# EAGLE design beamshutter (EAGLE 9.6.2)
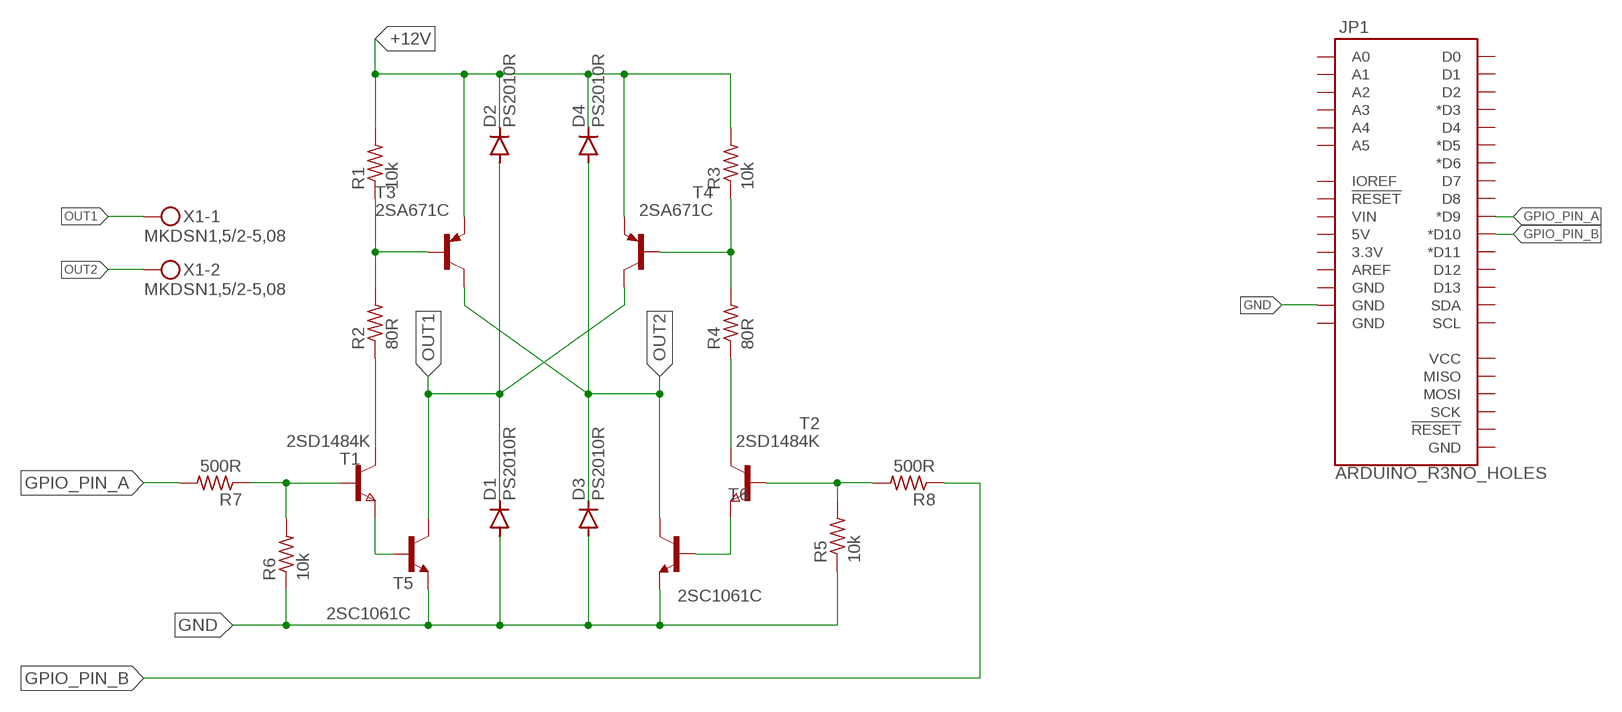
[diagram p0: schematic, sheet 1]

## Parts
D1  PS2010R  RGP15  [DO15-12]
D2  PS2010R  RGP15  [DO15-12]
D3  PS2010R  RGP15  [DO15-12]
D4  PS2010R  RGP15  [DO15-12]
JP1  ARDUINO_R3NO_HOLES  [ARDUINO_R3_NO_HOLES]
R1  10k  R-2012  [2012-R]
R2  80R  R-2012  [2012-R]
R3  10k  R-2012  [2012-R]
R4  80R  R-2012  [2012-R]
R5  10k  R-2012  [2012-R]
R6  10k  R-2012  [2012-R]
R7  500R  R-2012  [2012-R]
R8  500R  R-2012  [2012-R]
T1  2SD1484K  NPNSOT323  [SOT323]
T2  2SD1484K  NPNSOT323  [SOT323]
T3  2SA671C  -PNP-TO220V  [TO220V]
T4  2SA671C  -PNP-TO220V  [TO220V]
T5  2SC1061C  -NPN-TO220V  [TO220V]
T6  2SC1061C  -NPN-TO220V  [TO220V]
X1  MKDSN1,5/2-5,08  [MKDSN1,5/2-5,08]

## Nets
+12V: D2.C D4.C R1.2 R3.2 T3.3(E) T4.3(E)
GND: D1.A D3.A JP1.GND@3(GND) R5.1 R6.1 T5.3(E) T6.3(E)
GPIO_PIN_A: JP1.D9(*D9) R7.2
GPIO_PIN_B: JP1.D10(*D10) R8.1
N$1: R6.2 R7.1 T1.2(B)
N$2: R1.1 R2.2 T3.1(B)
N$3: R3.1 R4.2 T4.1(B)
N$4: R5.2 R8.2 T2.2(B)
N$5: T1.3(E) T5.1(B)
N$6: T2.3(E) T6.1(B)
N$7: R4.1 T2.1(C)
N$8: R2.1 T1.1(C)
OUT1: D1.C D2.A T4.2(C) T5.2(C) X1.1
OUT2: D3.C D4.A T3.2(C) T6.2(C) X1.2
Unconnected: JP1.3.3V JP1.5V JP1.A0 JP1.A1 JP1.A2 JP1.A3 JP1.A4 JP1.A5 JP1.AREF JP1.D0 JP1.D1 JP1.D2 JP1.D3(*D3) JP1.D4 JP1.D5(*D5) JP1.D6(*D6) JP1.D7 JP1.D8 JP1.D11(*D11) JP1.D12 JP1.D13 JP1.GND@1(GND) JP1.GND@2(GND) JP1.GND@4(GND) JP1.IOREF JP1.MISO JP1.MOSI JP1.RESET@1(!RESET!) JP1.RESET@2(!RESET!) JP1.SCK JP1.SCL JP1.SDA JP1.VCC JP1.VIN

## Library data of the parts
D1-D4 = diode:RGP15: DIODE fast-recovery rectifier
JP1 = SparkFun-Boards:ARDUINO_R3: Arduino R3 Footprint (w/ SPI header)
R1-R8 = Passive_Robotech:R
T1 T2 = zetex:NPNSOT323: NPN TRANSISTOR; MPN: DSS4160U-7; OC_FARNELL: 1710696; OC_NEWARK: 25R4558
T3 T4 = transistor:*-PNP-: PNP Transistror
T5 T6 = transistor:*-NPN-: NPN Transistror BF959 corrected 2008.03.06
X1 = con-phoenix-508:MKDSN1,5/2-5,08: MKDSN 1,5/ 2-5,08 Printklemme Nennstrom: 13,5 A Nennspannung: 250 V Rastermaß: 5,08 mm Polzahl: 2 Anschlussart: Schraubanschluss Montage: Löten Anschlussrichtung Leiter/Platine: 0 ° Artikelnummer: 1729128 Source: http://eshop.phoenixcontact.com .. 1729128.pdf

## Board
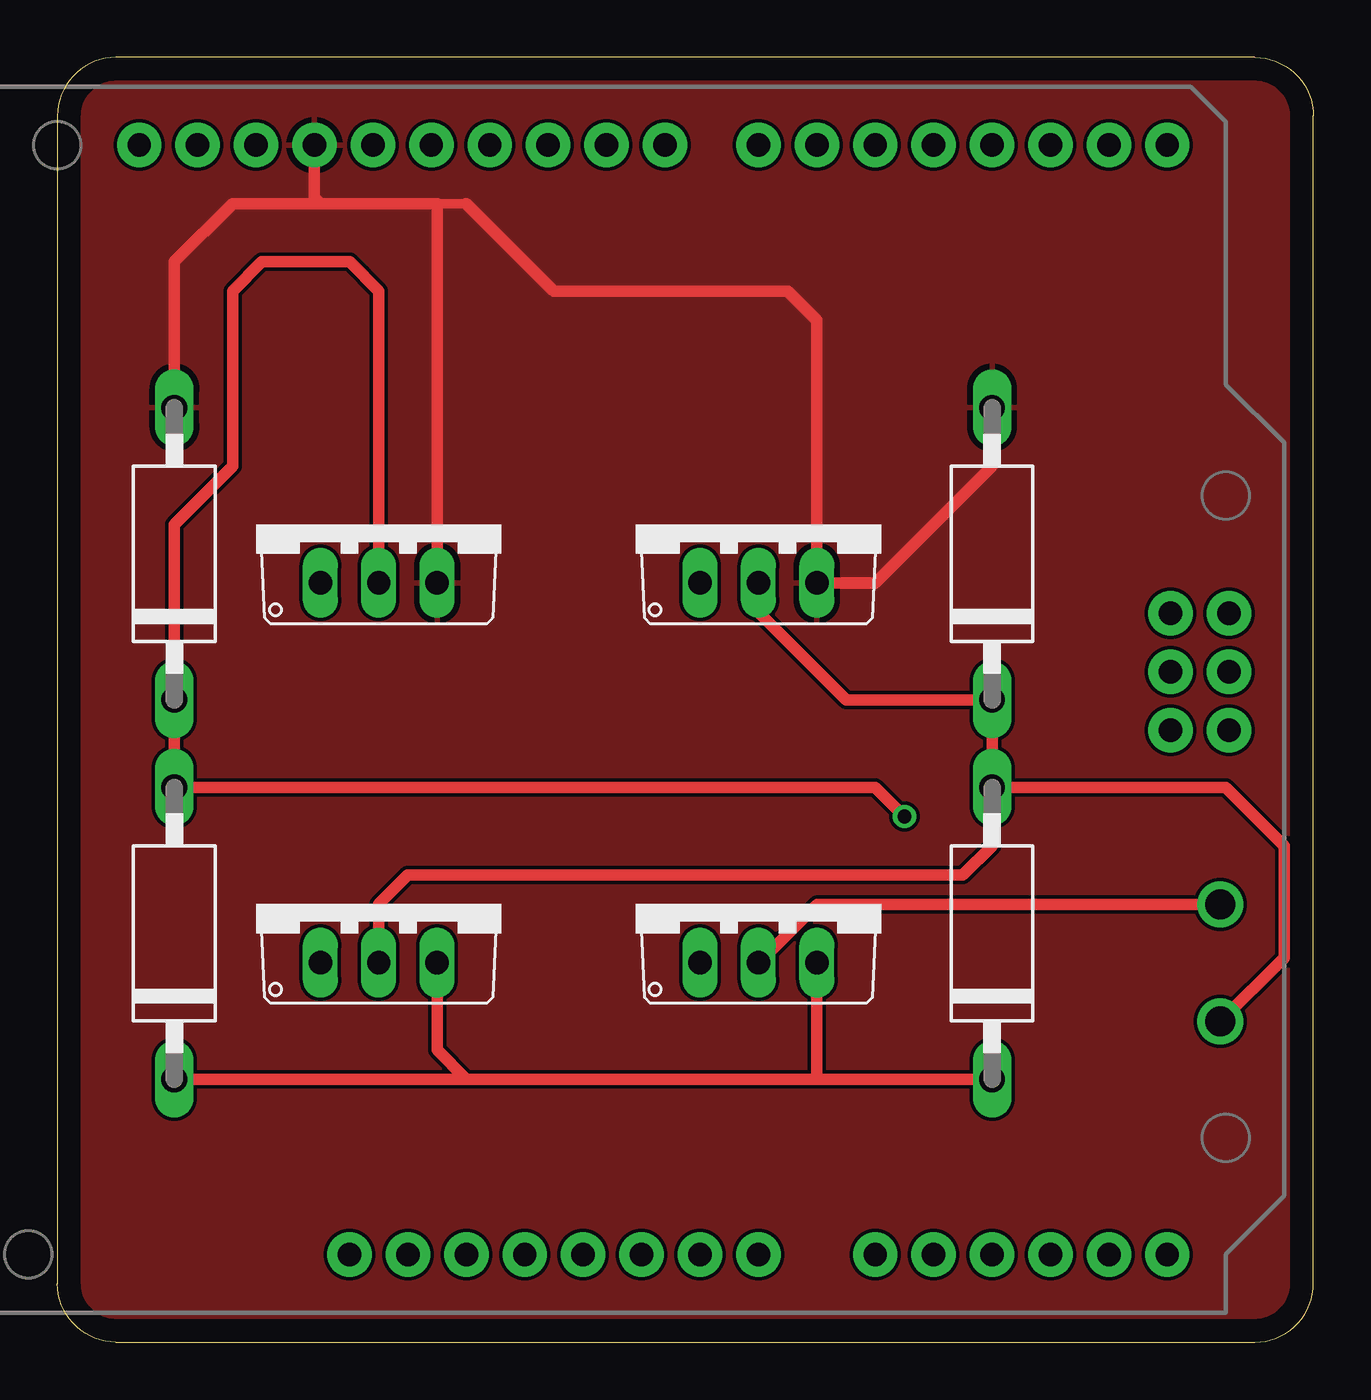
[diagram p1: board, top side]
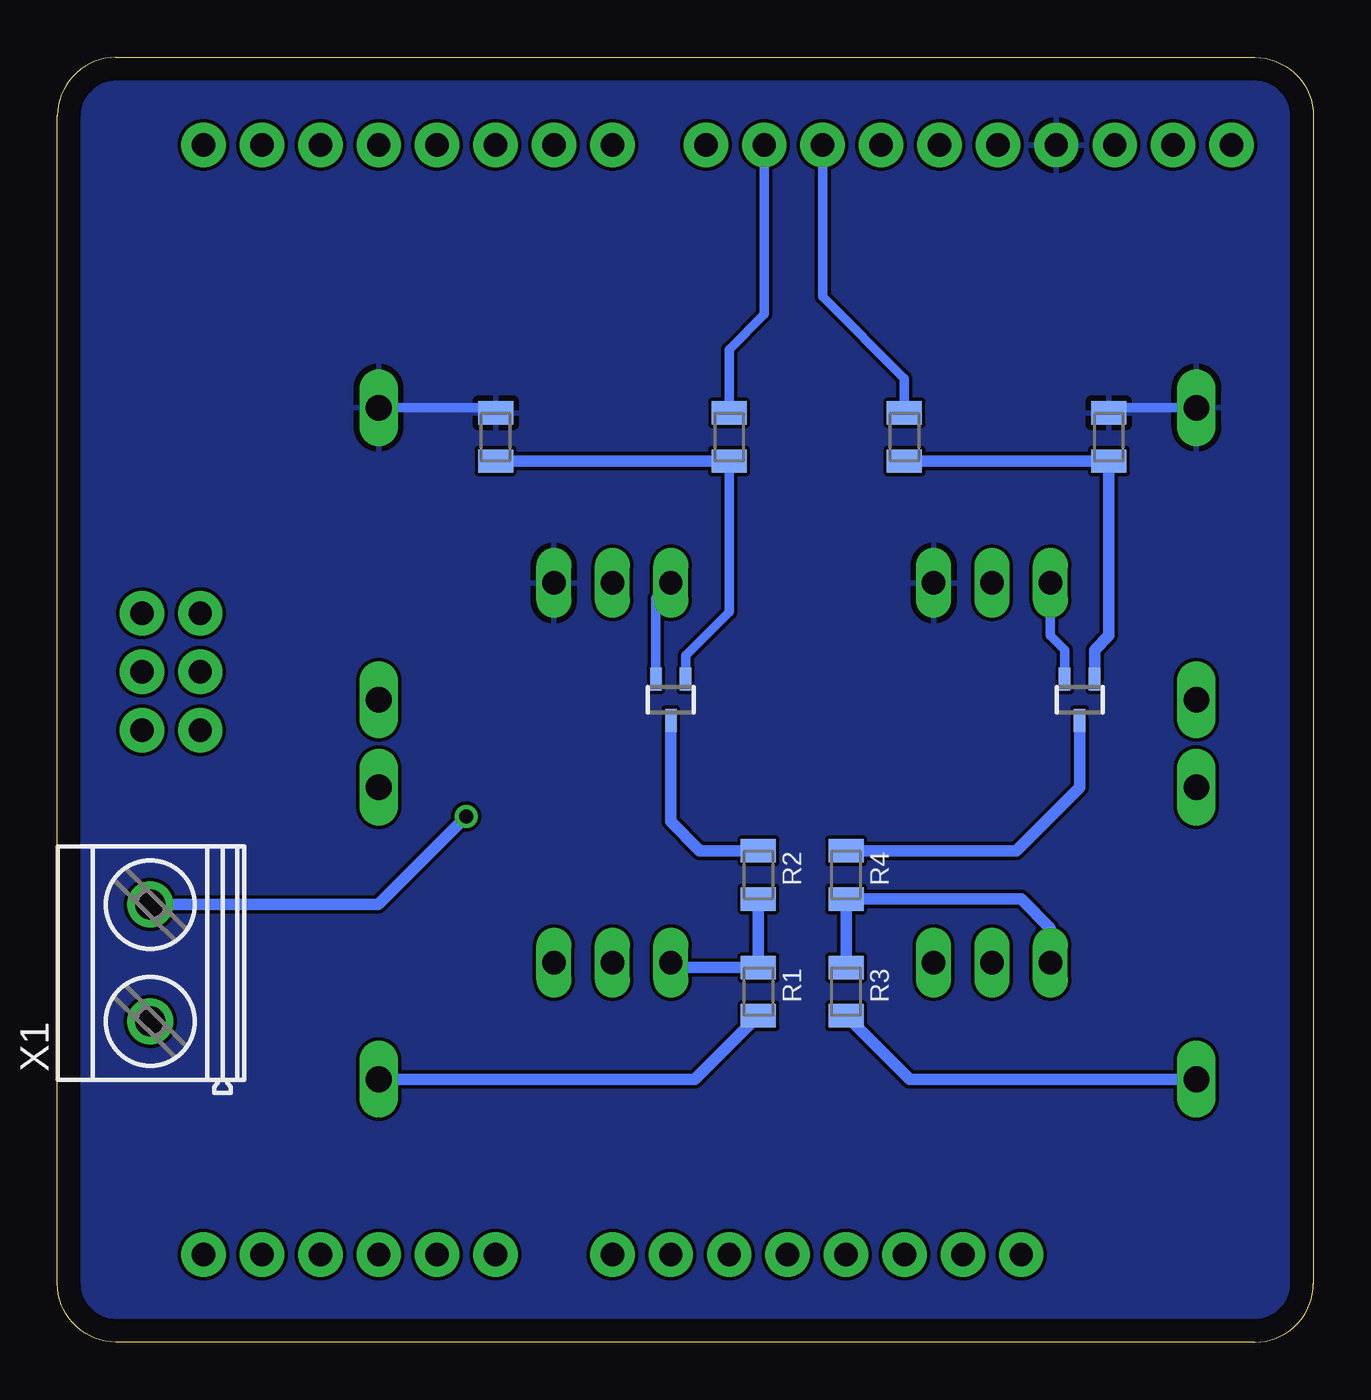
[diagram p2: board, bottom side, seen from below]

Size 54.61 x 55.88 mm. Coordinates in mm from the lower left corner, seen from the top.
Outline: 2.54,0 52.07,0 arc90 54.61,2.54 54.61,53.34 arc90 52.07,55.88 2.54,55.88 arc90 0,53.34 0,2.54 arc90 2.54,0
Copper layers (1*16): Top 0.035mm / dielectric 1.5mm / Bottom 0.035mm
Design rules "default": minimum track width 6mil, minimum drill 0.35mm, track to track 6mil, track to pad 6mil, pad to pad 6mil, via to via 6mil, smd to smd 6mil, copper to edge 40mil, drill to drill 6mil, minimum pad ring 10mil, minimum via ring 8mil, stop-mask expansion 4mil, vias tented up to drill 0mil, thermal gap 10mil

### Footprints (pad centres in the part's own frame; a part is rotated, then mirrored left to right if it is on the bottom)
DO15-12 = drill 1.118 long: A 6.35,0; C -6.35,0
ARDUINO_R3_NO_HOLES = drill 1.016 pad 1.93: 3.3V 35.56,2.54; 5V 38.1,2.54; A0 50.8,2.54; A1 53.34,2.54; A2 55.88,2.54; A3 58.42,2.54; A4 60.96,2.54; A5 63.5,2.54; AREF 23.876,50.8; D0 63.5,50.8; D1 60.96,50.8; D2 58.42,50.8; D3 55.88,50.8; D4 53.34,50.8; D5 50.8,50.8; D6 48.26,50.8; D7 45.72,50.8; D8 41.656,50.8; D9 39.116,50.8; D10 36.576,50.8; D11 34.036,50.8; D12 31.496,50.8; D13 28.956,50.8; GND@1 40.64,2.54; GND@2 43.18,2.54; GND@3 26.416,50.8; GND@4 66.18,25.35; IOREF 30.48,2.54; MISO 63.64,30.43; MOSI 66.18,27.89; NC 27.94,2.54; RESET@1 33.02,2.54; RESET@2 63.64,25.35; SCK 63.64,27.89; SCL 18.796,50.8; SDA 21.336,50.8; VCC 66.18,30.43; VIN 45.72,2.54
2012-R = smd 1.016 x 1.524: 1 -1.048,0; 2 1.048,0
SOT323 = smd 0.5 x 1: 1 0,0.9; 2 -0.65,-0.9; 3 0.65,-0.9
TO220V = drill 1.016 long: 1 -2.54,-2.54; 2 0,-2.54; 3 2.54,-2.54
MKDSN1,5/2-5,08 = drill 1.3 pad 2: 1 -2.561,0.025; 2 2.519,0.025

### Placement (x,y rotation side)
D1  40.64,34.29 90 top
D2  40.64,17.78 90 top
D3  5.08,34.29 90 top
D4  5.08,17.78 90 top
JP1  -15.24,1.27 0 top
R1  24.13,15.24 270 bottom
R2  24.13,20.32 270 bottom
R3  20.32,15.24 270 bottom
R4  20.32,20.32 270 bottom
R5  8.89,39.37 270 bottom
R6  35.56,39.37 270 bottom
R7  25.4,39.37 90 bottom
R8  17.78,39.37 270 bottom
T1  27.94,27.94 180 bottom
T2  10.16,27.94 180 bottom
T3  30.48,19.05 0 top
T4  13.97,19.05 0 top
T5  30.48,35.56 0 top
T6  13.97,35.56 0 top
X1  50.55,16.51 90 bottom

### Tracks (layer width: path | path; a pad name or v marks a point on that pad's centre or on a via)
+12V
  Top 0.508: T3.3 33.02,11.43 | 33.02,11.43 17.78,11.43 | 17.78,11.43 16.51,12.7 T4.3 | D2.C 33.02,11.43 | 17.78,11.43 D4.C
  Bottom 0.508: R3.2 17.56,11.43 D4.C | R1.2 26.89,11.43 D2.C
GND
  Top 0.406: 17.78,49.53 16.51,49.53
  Top 0.508: D1.A 40.64,38.1 35.56,33.02 T5.3 33.02,44.45 31.75,45.72 21.59,45.72 17.78,49.53 | JP1.GND@3 11.18,49.78 11.43,49.53 | D3.A 5.08,46.99 7.62,49.53 11.43,49.53 | 11.43,49.53 16.51,49.53 T6.3
  Bottom 0.406: R5.1 8.67,40.64 D3.A | R6.1 35.78,40.64 D1.A
  pour Bottom: 0,55.88 0,0 54.61,0 54.61,55.88
  pour Top: 0,55.88 0,0 54.61,0 54.61,55.88
GPIO_PIN_A
  Bottom 0.406: JP1.D9 23.88,44.7 25.4,43.18 R7.2
GPIO_PIN_B
  Bottom 0.406: R8.1 17.78,41.91 21.34,45.47 JP1.D10
N$1
  Bottom 0.406: T1.2 27.29,29.86 25.4,31.75 R7.1
  Bottom 0.508: R6.2 34.29,38.32 | R6.2 R7.1 | R6.2
N$2
  Bottom 0.508: R2.2 R1.1 27.72,16.29 T3.1
N$3
  Bottom 0.508: T4.1 11.43,17.78 11.43,18 12.7,19.27 R4.2 R3.1
N$4
  Bottom 0.508: R8.2 R5.2 8.89,30.73 9.51,30.11 T2.2
N$5
  Bottom 0.406: T5.1 28.59,32.37 T1.3
N$6
  Bottom 0.406: T2.3 10.81,30.11 11.43,30.73 T6.1
N$7
  Bottom 0.508: R4.1 12.92,21.37 10.16,24.13 T2.1
N$8
  Bottom 0.508: R2.1 26.67,21.37 27.94,22.64 T1.1
OUT1
  Top 0.508: T4.2 13.97,19.05 15.24,20.32 39.37,20.32 40.64,21.59 D2.A | T5.2 30.48,31.75 34.29,27.94 D1.C D2.A | X1.1 53.34,16.72 53.34,21.59 50.8,24.13 D2.A
OUT2  (via drill 0.6)
  Top 0.508: T6.2 13.97,45.72 12.7,46.99 8.89,46.99 7.62,45.72 7.62,38.1 5.08,35.56 D3.C D4.A 35.56,24.13 v36.83,22.86 | X1.2 33.04,19.03 30.52,16.51 T3.2
  Bottom 0.508: v36.83,22.86 40.66,19.03 X1.2